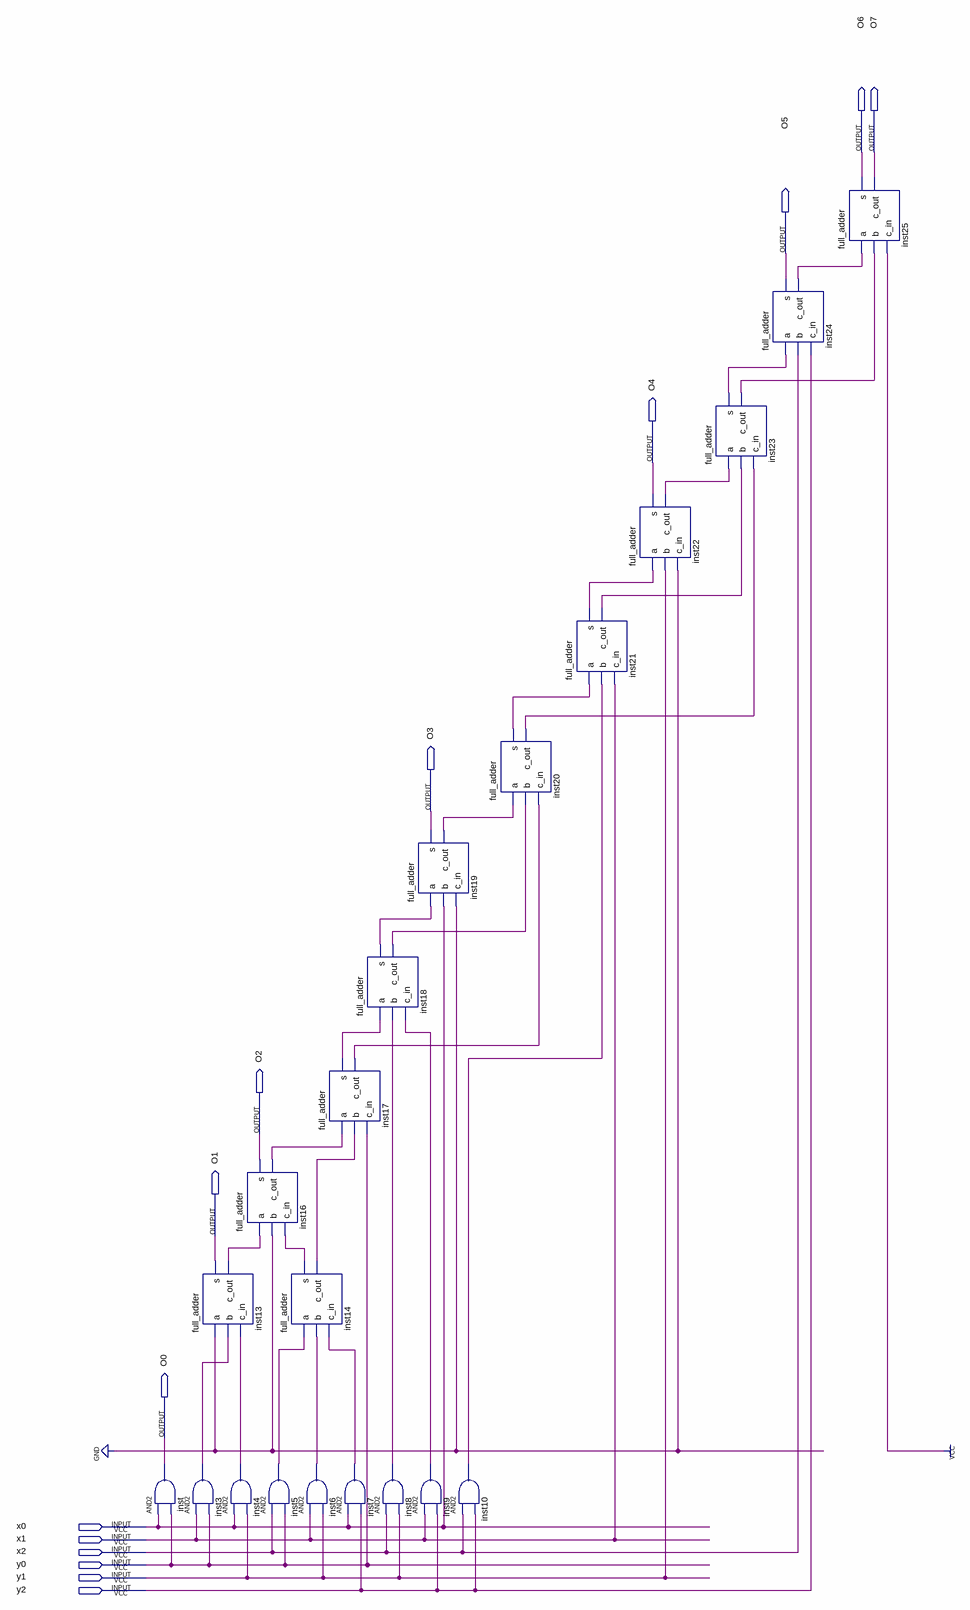
[diagram p0: schematic sheet]
// Quartus schematic Multiplier-3bit.bdf as structural Verilog: 21 symbols, 14 pins
module \Multiplier-3bit  (
  input  x0,
  input  x1,
  input  x2,
  input  y0,
  input  y1,
  input  y2,
  output O6,
  output O7,
  output O5,
  output O4,
  output O3,
  output O2,
  output O1,
  output O0
);

  wire inst3_out, inst4_out, inst5_out, inst6_out, inst7_out, inst8_out, inst9_out, inst10_out, inst13_c_out,
       inst14_c_out, inst14_s, inst16_c_out, inst17_c_out, inst17_s, inst18_c_out, inst18_s, inst19_c_out,
       inst20_c_out, inst20_s, inst21_c_out, inst21_s, inst22_c_out, inst23_c_out, inst23_s, inst24_c_out;

  and inst (O0, x0, y0);
  full_adder inst13 (.a(1'b0), .b(inst3_out), .c_in(inst4_out), .s(O1), .c_out(inst13_c_out));
  and inst3 (inst3_out, x1, y0);
  and inst4 (inst4_out, x0, y1);
  full_adder inst16 (.a(inst13_c_out), .b(1'b0), .c_in(inst14_s), .s(O2), .c_out(inst16_c_out));
  full_adder inst14 (.a(inst5_out), .b(inst6_out), .c_in(inst7_out), .s(inst14_s), .c_out(inst14_c_out));
  and inst5 (inst5_out, x2, y0);
  full_adder inst17 (.a(inst16_c_out), .b(inst14_c_out), .c_in(y0), .s(inst17_s), .c_out(inst17_c_out));
  and inst6 (inst6_out, x1, y1);
  full_adder inst18 (.a(inst17_s), .b(inst8_out), .c_in(inst9_out), .s(inst18_s), .c_out(inst18_c_out));
  and inst7 (inst7_out, x0, y2);
  and inst8 (inst8_out, x2, y1);
  full_adder inst19 (.a(inst18_s), .b(x0), .c_in(1'b0), .s(O3), .c_out(inst19_c_out));
  and inst9 (inst9_out, x1, y2);
  and inst10 (inst10_out, x2, y2);
  full_adder inst20 (.a(inst19_c_out), .b(inst18_c_out), .c_in(inst17_c_out), .s(inst20_s), .c_out(inst20_c_out));
  full_adder inst21 (.a(inst20_s), .b(inst10_out), .c_in(x1), .s(inst21_s), .c_out(inst21_c_out));
  full_adder inst22 (.a(inst21_s), .b(y1), .c_in(1'b0), .s(O4), .c_out(inst22_c_out));
  full_adder inst23 (.a(inst22_c_out), .b(inst21_c_out), .c_in(inst20_c_out), .s(inst23_s), .c_out(inst23_c_out));
  full_adder inst24 (.a(inst23_s), .b(x2), .c_in(y2), .s(O5), .c_out(inst24_c_out));
  full_adder inst25 (.a(inst24_c_out), .b(inst23_c_out), .c_in(1'b1), .s(O6), .c_out(O7));
endmodule
